# EasyEDA Pro project ProPrj_51boardtest_2024-12-12.epro

# Schematic 51board_Schematic
Board Name: Board1; Create Date: 2024-12-11; Page Name: P1; Project Name: 51board; Schematic Name: 51board_Schematic; Update Date: 2024-12-11; Company: DUOBAO; Drawed: yunshu; Page Size: A4; Version: V1.0
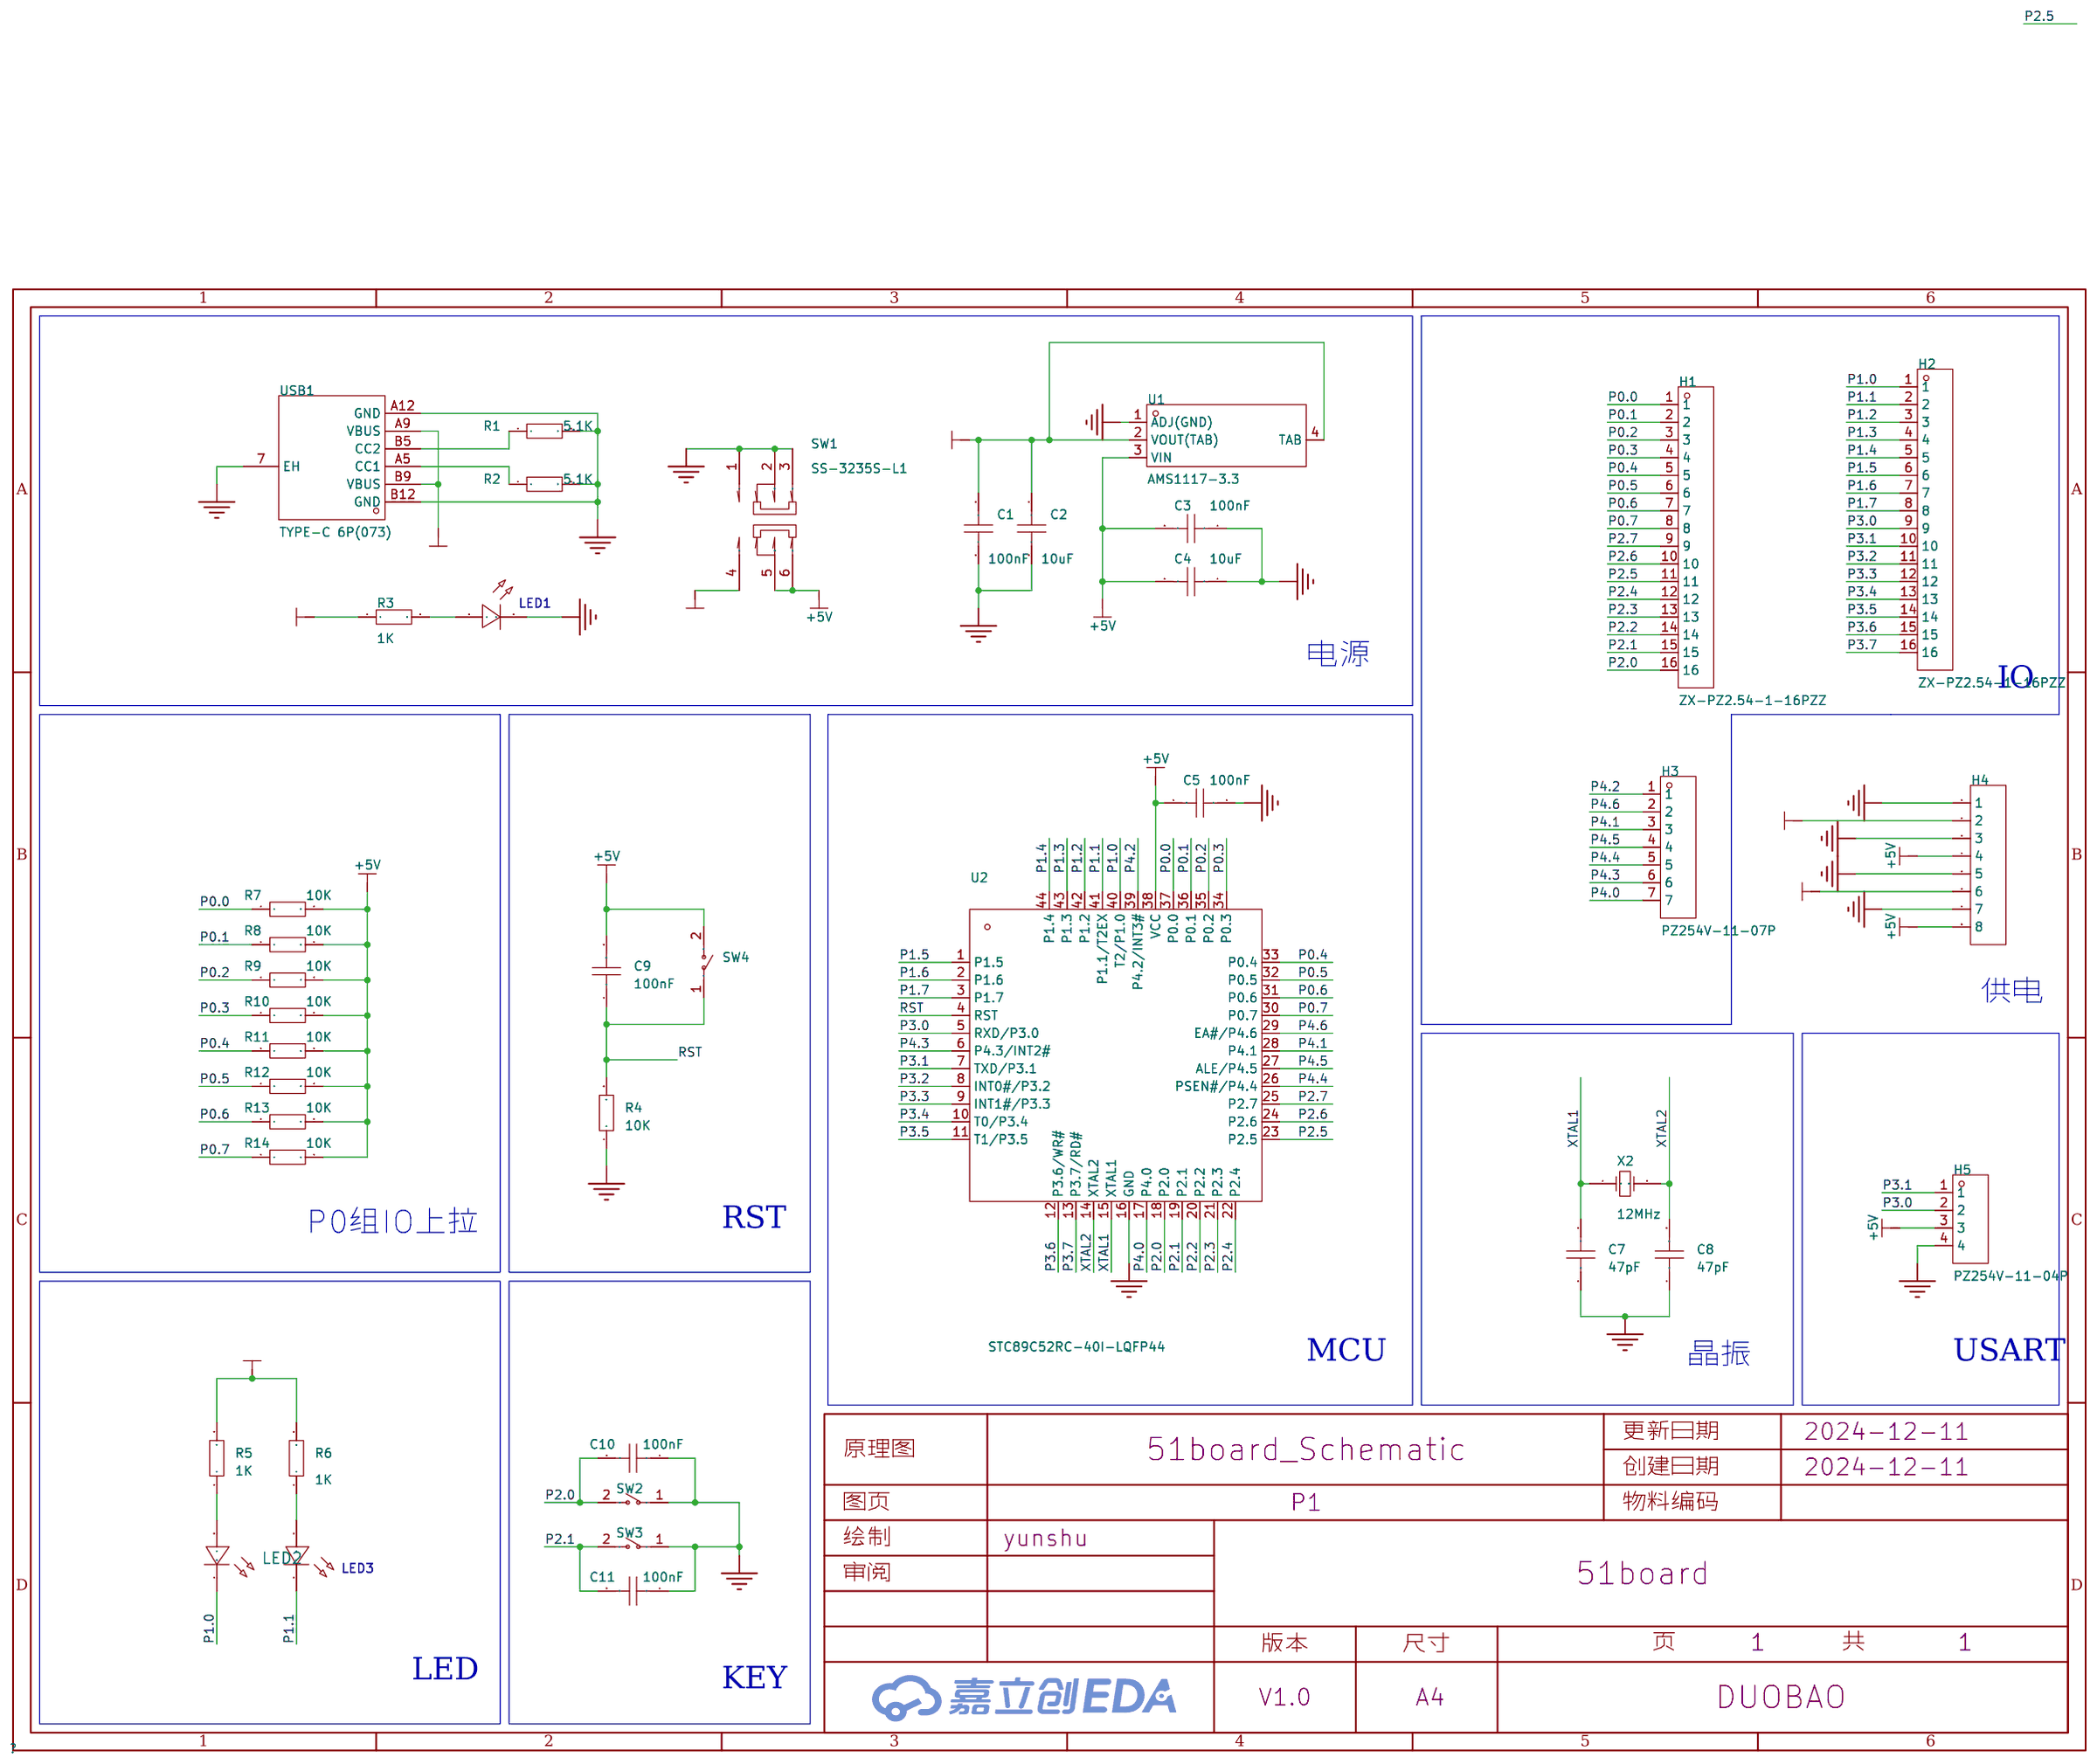
[diagram p0: schematic sheet]

## Parts
C1  100nF  [C0805]
C2  10uF  [C0805]
C3  100nF  [C0805]
C4  10uF  [C0805]
C5  100nF  [C0805]
C7  47pF  [C0805]
C8  47pF  [C0805]
C9  100nF  [C0805]
C10  100nF  [C0805]
C11  100nF  [C0805]
H1  ZX-PZ2.54-1-16PZZ  [HDR-TH_16P-P2.54-V-M-2]
H2  ZX-PZ2.54-1-16PZZ  [HDR-TH_16P-P2.54-V-M-2]
H3  PZ254V-11-07P  [HDR-TH_7P-P2.54-V-M]
H4  -  [HDR-TH_8P-P2.54-V-F-1]
H5  PZ254V-11-04P  [HDR-TH_4P-P2.54-V-M]
LED1  -  [LED_0805]
LED2  -  [LED_0805]
LED3  -  [LED_0805]
R1  5.1K  [R0805]
R2  5.1K  [R0805]
R3  1K  [R0805]
R4  10K  [R0805]
R5  1K  [R0805]
R6  1K  [R0805]
R7  10K  [R0805]
R8  10K  [R0805]
R9  10K  [R0805]
R10  10K  [R0805]
R11  10K  [R0805]
R12  10K  [R0805]
R13  10K  [R0805]
R14  10K  [R0805]
SW1  SS-3235S-L1  [SW-SMD_SS-3235S-LX]
SW2  轻触按键 3x6x2.5mm  [SW-SMD_L6.1-W3.7-LS8.0]
SW3  轻触按键 3x6x2.5mm  [SW-SMD_L6.1-W3.7-LS8.0]
SW4  轻触按键 3x6x2.5mm  [SW-SMD_L6.1-W3.7-LS8.0]
U1  AMS1117-3.3  [SOT-223-4_L6.5-W3.5-P2.30-LS7.0-BR]
U2  STC89C52RC-40I-LQFP44  [LQFP-44_L10.0-W10.0-P0.80-LS12.0-BL]
USB1  TYPE-C 6P(073)  [TYPE-C-SMD_TYPE-C-6P_5]
X2  12MHz  [OSC-TH_BD2.0-P0.50]

## Library data of the parts
C1-C5 C7-C11 = CAP_0805: Supplier Footprint: 0805
H1 H2 = ZX-PZ2.54-1-16PZZ: 插针结构:1x16P;间距:2.54mm;行距:-;圆针/方针:方针;安装类型:直插;排数:单排;总PIN位数:16P;额定电流:3A;额定电压:1kV;配合针长度:6mm;塑高:2.5mm;端接针长度:3mm;触头材质:黄铜;触头镀层:金;工作温度范围:-40℃~+105℃;焊接温度(最大值):-;颜色:黑色;; LCSC Part Name: 1x16P 间距:2.54mm 方针 直插; Supplier Part: C7501270; Manufacturer: Megastar(兆星); Supplier Footprint: 插件,P=2.54mm; JLCPCB Part Class: Extended Part; Datasheet: https://atta.szlcsc.com/upload/public/pdf/source/20231122/E454B24BEC0C004E7BA34E686CD1994E.pdf; Supplier: LCSC; Pin Structure: 1x16P; Pitch: 2.54mm; Circluar Pins/Square Pins: 方针; Mounting Type: 直插; Number of Rows: 单排; Number of Pins: 16P; Current Rating (Max): 3A; Voltage Rating (Max): 1kV; Length of Mating Pin: 6mm; Insulation Height: 2.5mm; Length of End Connection Pin: 3mm; Contact Material: 黄铜; Contact Plating: 金; Operating Temperature Range: -40℃~+105℃; Color: 黑色
H3 = PZ254V-11-07P: 插针结构:1x7P;间距:2.54mm;行距:-;圆针/方针:方针;安装类型:直插;排数:单排;总PIN位数:7P;额定电流:-;额定电压:-;配合针长度:6mm;塑高:2.5mm;端接针长度:3mm;触头材质:黄铜;触头镀层:-;工作温度范围:-40℃~+105℃;颜色:黑色;; LCSC Part Name: 间距:2.54mm 1x7P 直插 方针; Supplier Part: C492406; Manufacturer: XFCN(兴飞); Supplier Footprint: 插件,P=2.54mm; JLCPCB Part Class: Extended Part; Datasheet: https://atta.szlcsc.com/upload/public/pdf/source/20200309/C492406_654C533EE691117E22DD9F76C114C2D9.pdf; Supplier: LCSC; Pin Structure: 1x7P; Pitch: 2.54mm; Circluar Pins/Square Pins: 方针; Mounting Type: 直插; Number of Rows: 单排; Number of Pins: 7P; Length of Mating Pin: 6mm; Insulation Height: 2.5mm; Length of End Connection Pin: 3mm; Contact Material: 黄铜; Operating Temperature Range: -40℃~+105℃; Color: 黑色
H4 = HDR-F_2.54_1x8P: Supplier Part: C27438; Supplier Footprint: 插件
H5 = PZ254V-11-04P: 插针结构:1x4P;间距:2.54mm;行距:-;圆针/方针:方针;安装类型:直插;排数:单排;总PIN位数:4P;额定电流:3A;额定电压:250V;配合针长度:6mm;塑高:2.5mm;端接针长度:3mm;触头材质:-;工作温度范围:-40℃~+105℃;颜色:黑色;; LCSC Part Name: 间距:2.54mm 1x4P 直插 方针; Supplier Part: C2691448; Manufacturer: XFCN(兴飞); Supplier Footprint: 插件,P=2.54mm; JLCPCB Part Class: Extended Part; Datasheet: https://atta.szlcsc.com/upload/public/pdf/source/20200309/C492403_F9F19131791D08044AD4F84F8E751A34.pdf; Supplier: LCSC; Pin Structure: 1x4P; Pitch: 2.54mm; Circluar Pins/Square Pins: 方针; Mounting Type: 直插; Number of Rows: 单排; Number of Pins: 4P; Current Rating (Max): 3A; Voltage Rating (Max): 250V; Length of Mating Pin: 6mm; Insulation Height: 2.5mm; Length of End Connection Pin: 3mm; Operating Temperature Range: -40℃~+105℃; Color: 黑色
LED1 = LED_0805-G: Supplier Footprint: 0805
LED2 = LED_0805-R: Supplier Footprint: 0805
LED3 = LED_0805-B: Supplier Footprint: 0805
R1-R14 = Res_0805: Supplier Footprint: 0805
SW1 = SS-3235S-L1: 电路结构:双刀双掷;安装方式:卧贴;开关颜色:黑色;额定电流(DC):50mA;额定电压(DC):12V;额定电流(AC):50mA;额定电压(AC):12V;机械寿命:1万次;; LCSC Part Name: 柄长2mm 卧贴双档 滑动开关; Supplier Part: C500055; Manufacturer: XKB Connectivity(中国星坤); Supplier Footprint: SMD; JLCPCB Part Class: 扩展库; Datasheet: https://atta.szlcsc.com/upload/public/pdf/source/20211011/39D516E750C13BE9339464E723D9F132.pdf; Supplier: LCSC; Circuit: 双刀双掷; Actuator Style: 矩形柱状; Pin Style: 鸥翼型; Switch Length: 9.1mm; Switch Width: 3.55mm; Switch Height: 3.2mm; Mounting Style: 卧贴; Actuator Color: 黑色; Current Rating (DC): 50mA; Voltage Rating (DC): 12V; Current Rating (AC): 50mA; Voltage Rating (AC): 12V; Mechanical Life: 1万次; Operating Temperature: -40℃~+85℃
SW2-SW4 = 轻触按键 3x6x2.5mm_C5116372: 开关长度:6.05mm;开关宽度:3.65mm;开关高度:2.5mm;机械寿命:-;; Supplier Part: C5116372; Manufacturer: BBJ; Supplier Footprint: SMD; JLCPCB Part Class: 扩展库; Datasheet: https://atta.szlcsc.com/upload/public/pdf/source/20220725/9B611EB1AF8F1817AB348C1FCD97BDC0.pdf; Supplier: LCSC; Switch Length: 6.05mm; Switch Width: 3.65mm; Switch Height: 2.5mm
U1 = AMS1117-3.3_C347222: 输出类型:固定;最大输入电压:18V;输出电压:3.3V;输出电流:1A;电源纹波抑制比(PSRR):60dB@(120Hz);输出极性:正极;; LCSC Part Name: 输出:3.3V 电流:1A 耐压:12V; Supplier Part: C347222; Manufacturer: UMW(友台半导体); Supplier Footprint: SOT-223; JLCPCB Part Class: 扩展库; Datasheet: https://atta.szlcsc.com/upload/public/pdf/source/20231109/155D79A26D9DB04352555A58D5969DC8.pdf; Supplier: LCSC; Output Type: 固定; Maximum Input Voltage: 18V; Output Voltage: 3.3V; Output Current: 1A; Power Supply Rejection Ratio (PSRR): 60dB@(120Hz); Dropout Voltage: 1.3V@(1A); Feature: 过流保护(OCP); Output Polarity: 正极; Number of Outputs: 1
U2 = STC89C52RC-40I-LQFP44: CPU内核:51系列;程序存储容量:8KB;RAM总容量:512Byte;GPIO端口数量:39;工作电压范围:3.3V~5.5V;CPU最大主频:-;程序存储器类型:FLASH;; Supplier Part: C8707; Manufacturer: STC(宏晶); Supplier Footprint: LQFP-44(10x10); JLCPCB Part Class: 扩展库; Datasheet: https://atta.szlcsc.com/upload/public/pdf/source/20131218/1457706663573.pdf; Supplier: LCSC; CPU Core: 51系列; Program Storage Size: 8KB; RAM Size: 512Byte; GPIO Ports Number: 39; Operating Voltage Range: 3.3V~5.5V; Program Memory Type: FLASH; Operating Temperature Range: -40℃~+85℃; 16Bit Timer: 3; UART/USART: 1; Peripheral/Function: 看门狗; Watchdog: 有
USB1 = TYPE-C 6P(073): 连接器类型:Type-C;标准:USB 3.1;公母:母;安装方式:卧贴;触点数量:6P;端口数量:1;额定电流 - 电源:3A;工作温度范围:-25℃~+85℃;; LCSC Part Name: Type-C 母 卧贴; Supplier Part: C668623; Manufacturer: SHOU HAN(首韩); Supplier Footprint: SMD; JLCPCB Part Class: 扩展库; Datasheet: https://atta.szlcsc.com/upload/public/pdf/source/20200618/C668623_A4B260DED7AC1949BAC6AE39E9F4CD80.pdf; Supplier: LCSC; Connector Type: Type-C; Standard: USB 3.1; Gender: 母; Mounting Style: 卧贴; Number of Contacts: 6P; Number of Ports: 1; Current Rating - Power (Max): 3A; Operating Temperature Range: -25℃~+85℃; Rated Voltage (Max): 5V; Connect-Disconnect Life: 1万次; Core Colour: 黑色
X2 = TXD12M0002206LDBEO00S: 晶振类型:直插晶振;频率:12MHz;常温频差:±20ppm;外接负载电容:20pF;频率稳定度(全温):±30ppm;; LCSC Part Name: 12MHz ±20ppm 20pF; Supplier Part: C370892; Manufacturer: YJX(雅晶鑫); Supplier Footprint: DT-26; JLCPCB Part Class: 扩展库; Datasheet: https://atta.szlcsc.com/upload/public/pdf/source/20190212/C370892_CB1688440A1A1FED16C5B19E0C68FC7A.pdf; Supplier: LCSC; Crystal Type: 直插晶振; Normal temperature Frequency Tolerance: ±20ppm; External load capacitor: 20pF; Frequency Stability(Full temperature range): ±30ppm; Equivalent Series Resistance (ESR): 80Ω; Operating Temperature: -20℃~+70℃

## Nets
+5V: C3.2 C4.2 C5.1 C9.2 H4.4 H4.8 H5.3 R7.2 R8.2 R9.2 R10.2 R11.2 R12.2 R13.2 R14.2 SW1.5 SW1.6 SW4.2 U1.3(VIN) U2.38(VCC)
GND: C1.2 C2.2 C3.1 C4.1 C5.2 C7.1 C8.1 C10.1 C11.1 H4.1 H4.3 H4.5 H4.7 H5.4 LED1.1(C) R1.2 R2.2 R4.1 SW1.1 SW1.2 SW1.3 SW2.1 SW3.1 U1.1(ADJ(GND)) U2.16(GND) USB1.7(EH) USB1.A12(GND) USB1.B12(GND)
VCC+3.3V: C1.1 C2.1 H4.2 H4.6 R3.1 R5.2 R6.2 U1.2(VOUT(TAB)) U1.4(TAB)
VCC+5V: SW1.4 USB1.A9(VBUS) USB1.B9(VBUS)
P0.0: H1.1 R7.1 U2.37(P0.0)
P0.1: H1.2 R8.1 U2.36(P0.1)
P0.2: H1.3 R9.1 U2.35(P0.2)
P0.3: H1.4 R10.1 U2.34(P0.3)
P0.4: H1.5 R11.1 U2.33(P0.4)
P0.5: H1.6 R12.1 U2.32(P0.5)
P0.6: H1.7 R13.1 U2.31(P0.6)
P0.7: H1.8 R14.1 U2.30(P0.7)
P1.0: H2.1 LED2.1(C) U2.40(T2/P1.0)
P1.1: H2.2 LED3.1(C) U2.41(P1.1/T2EX)
P1.2: H2.3 U2.42(P1.2)
P1.3: H2.4 U2.43(P1.3)
P1.4: H2.5 U2.44(P1.4)
P1.5: H2.6 U2.1(P1.5)
P1.6: H2.7 U2.2(P1.6)
P1.7: H2.8 U2.3(P1.7)
P2.0: C10.2 H1.16 SW2.2 U2.18(P2.0)
P2.1: C11.2 H1.15 SW3.2 U2.19(P2.1)
P2.2: H1.14 U2.20(P2.2)
P2.3: H1.13 U2.21(P2.3)
P2.4: H1.12 U2.22(P2.4)
P2.5: H1.11 U2.23(P2.5)
P2.6: H1.10 U2.24(P2.6)
P2.7: H1.9 U2.25(P2.7)
P3.0: H2.9 H5.2 U2.5(RXD/P3.0)
P3.1: H2.10 H5.1 U2.7(TXD/P3.1)
P3.2: H2.11 U2.8(INT0#/P3.2)
P3.3: H2.12 U2.9(INT1#/P3.3)
P3.4: H2.13 U2.10(T0/P3.4)
P3.5: H2.14 U2.11(T1/P3.5)
P3.6: H2.15 U2.12(P3.6/WR#)
P3.7: H2.16 U2.13(P3.7/RD#)
P4.0: H3.7 U2.17(P4.0)
P4.1: H3.3 U2.28(P4.1)
P4.2: H3.1 U2.39(P4.2/INT3#)
P4.3: H3.6 U2.6(P4.3/INT2#)
P4.4: H3.5 U2.26(PSEN#/P4.4)
P4.5: H3.4 U2.27(ALE/P4.5)
P4.6: H3.2 U2.29(EA#/P4.6)
RST: C9.1 R4.2 SW4.1 U2.4(RST)
XTAL1: C7.2 U2.15(XTAL1) X2.1(OSC1)
XTAL2: C8.2 U2.14(XTAL2) X2.2(OSC2)
$LED1_2: LED1.2(A) R3.2
$LED2_2: LED2.2(A) R5.1
$LED3_2: LED3.2(A) R6.1
$R1_1: R1.1 USB1.B5(CC2)
$R2_1: R2.1 USB1.A5(CC1)

## Notes on the sheet
- 电源
- IO
- 供电
- P0组IO上拉
- RST
- MCU
- 晶振
- USART
- LED
- KEY

# Board 51board_PCB
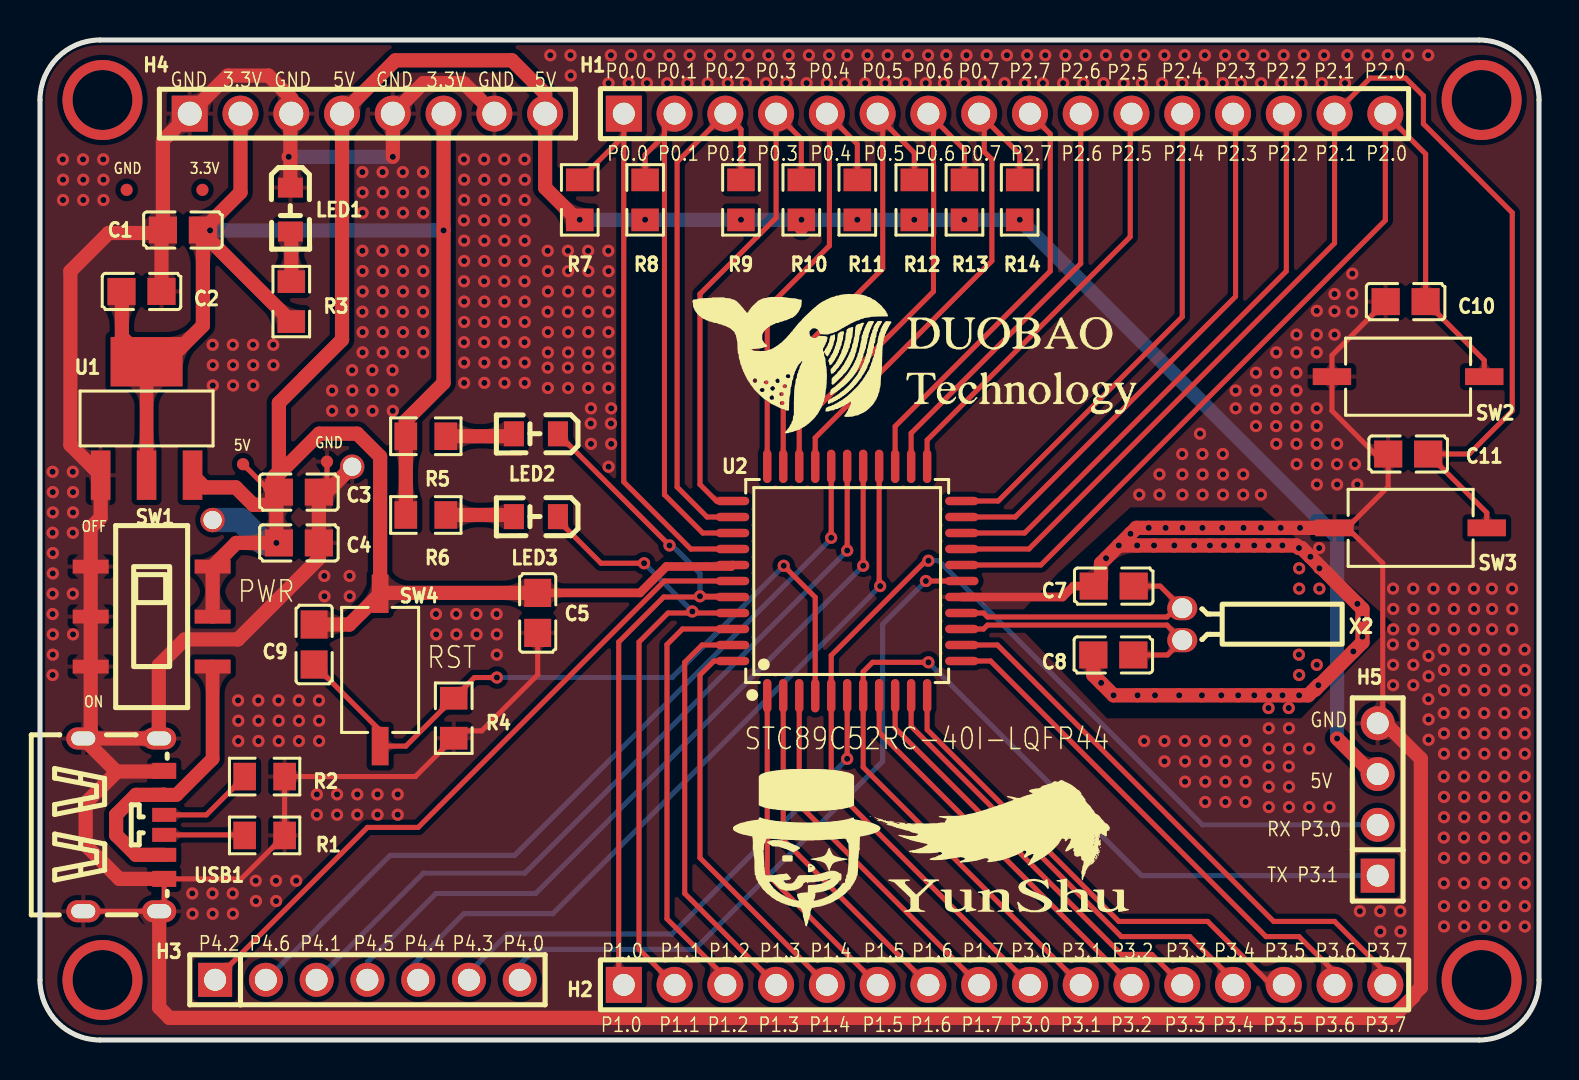
[diagram p1: board, top side]
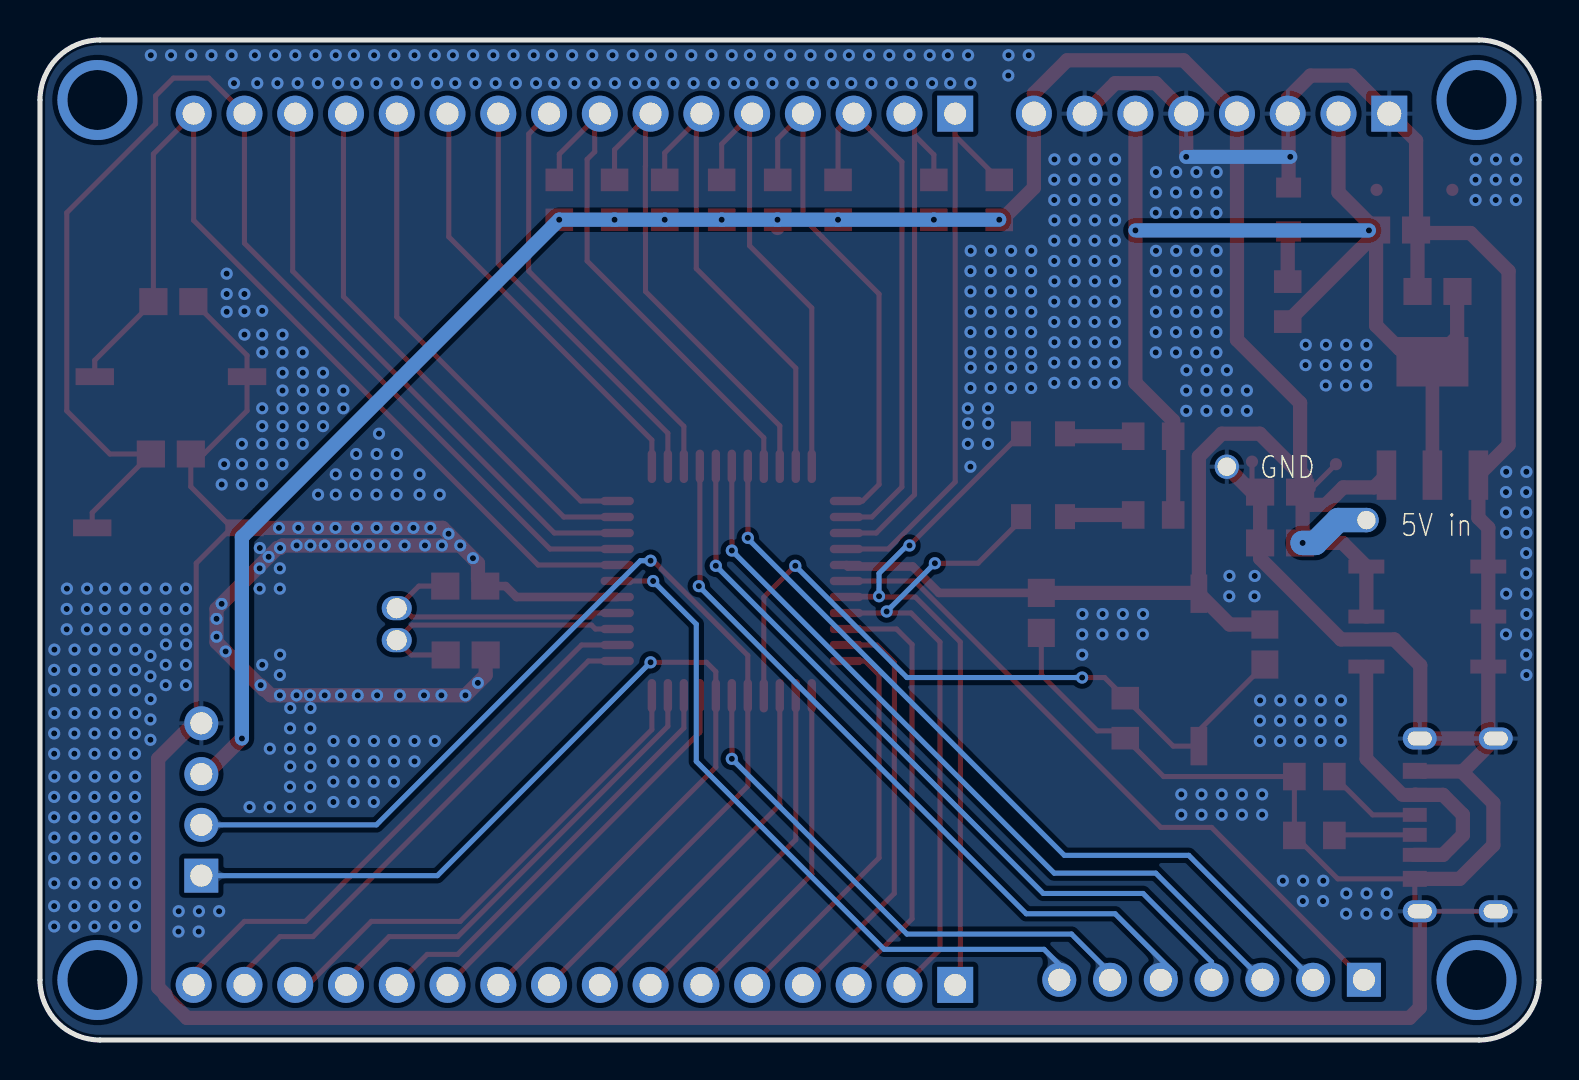
[diagram p2: board, bottom side, seen from below]

Outline 75 x 50 mm; copper layers: Top Layer, Bottom Layer. Coordinates in mm from the lower left corner of the outline.
Outline path: 0,47 0,3 arc(0.88,0.88) 3,0 72,0 arc(74.12,0.88) 75,3 75,47 arc(74.12,49.12) 72,50 3,50 arc(0.88,49.12) 0,47
Stack: Top Layer 0.035mm / Dielectric1 1.51mm FR4 er 4.5 / Bottom Layer 0.035mm

## Design rules (mm)
net XTAL1: DP1
net XTAL2: DP1
template: 自定义配置
spacing copperThickness1oz (default): track to track 0.102, other pairs 0.152 to 0.3
spacing copperThickness2oz: track to track 0.203, other pairs 0.152 to 0.3
track width copperThickness1oz (default): min 0.127, default 0.254, max 2.54
track width copperThickness2oz: min 0.203, default 0.254, max 2.54
differential pair differentialPair (default): width min 0.127, default 0.254, max 2.54; gap min 0.152, default 0.152
via viaSize (default): diameter min 0.5, default 0.61, max 10; hole min 0.3, default 0.305, max 6.299

## Placement (name value [footprint] x y rotation side)
C1  100nF  [C0805]  7.15 40.5 180 top
C2  10uF  [C0805]  5.08 37.43 0 top
C3  100nF  [C0805]  12.95 27.39 180 top
C4  10uF  [C0805]  12.95 24.85 180 top
C5  100nF  [C0805]  24.9 21.35 270 top
C7  47pF  [C0805]  53.72 22.69 0 top
C8  47pF  [C0805]  53.7 19.25 0 top
C9  100nF  [C0805]  13.72 19.77 90 top
C10  100nF  [C0805]  68.33 36.92 0 top
C11  100nF  [C0805]  68.45 29.3 0 top
H1  ZX-PZ2.54-1-16PZZ  [HDR-TH_16P-P2.54-V-M-2]  48.26 46.32 0 top
H2  ZX-PZ2.54-1-16PZZ  [HDR-TH_16P-P2.54-V-M-2]  48.26 2.76 0 top
H3  PZ254V-11-07P  [HDR-TH_7P-P2.54-V-M]  16.38 3.01 0 top
H4  -  [HDR-TH_8P-P2.54-V-F-1]  16.38 46.32 0 top
H5  PZ254V-11-04P  [HDR-TH_4P-P2.54-V-M]  66.93 12.03 90 top
LED1  -  [LED_0805]  12.52 41.47 270 top
LED2  -  [LED_0805]  24.77 30.31 180 top
LED3  -  [LED_0805]  24.77 26.17 180 top
NOREF  -  [Pad_e2690]  10.16 28.79 0 top
NOREF#2  -  [Pad_e2691]  14.36 28.92 0 top
NOREF#3  -  [Pad_e4806]  15.62 28.66 0 top
NOREF#4  -  [Pad_e5037]  8.64 26 0 top
NOREF#5  -  [Pad_e2711]  4.34 42.51 0 top
NOREF#6  -  [Pad_e2710]  8.13 42.51 0 top
R1  5.1K  [R0805]  11.24 10.23 0 top
R2  5.1K  [R0805]  11.24 13.17 0 top
R3  1K  [R0805]  12.57 36.92 90 top
R4  10K  [R0805]  20.7 16.09 90 top
R5  1K  [R0805]  19.3 30.19 180 top
R6  1K  [R0805]  19.3 26.25 180 top
R7  10K  [R0805]  27.01 42.01 270 top
R8  10K  [R0805]  30.28 42.01 270 top
R9  10K  [R0805]  35.07 42.01 270 top
R10  10K  [R0805]  38.09 42.01 270 top
R11  10K  [R0805]  40.89 42.01 270 top
R12  10K  [R0805]  43.74 42.01 270 top
R13  10K  [R0805]  46.25 42.01 270 top
R14  10K  [R0805]  49.02 42.01 270 top
SW1  SS-3235S-L1  [SW-SMD_SS-3235S-LX]  5.59 21.17 90 top
SW2  轻触按键 3x6x2.5mm  [SW-SMD_L6.1-W3.7-LS8.0]  68.45 33.17 180 top
SW3  轻触按键 3x6x2.5mm  [SW-SMD_L6.1-W3.7-LS8.0]  68.58 25.61 180 top
SW4  轻触按键 3x6x2.5mm  [SW-SMD_L6.1-W3.7-LS8.0]  17.02 18.5 270 top
U1  AMS1117-3.3  [SOT-223-4_L6.5-W3.5-P2.30-LS7.0-BR]  5.33 31.08 270 top
U2  STC89C52RC-40I-LQFP44  [LQFP-44_L10.0-W10.0-P0.80-LS12.0-BL]  40.39 22.95 0 top
USB1  TYPE-C 6P(073)  [TYPE-C-SMD_TYPE-C-6P_5]  4.19 10.76 270 top
X2  12MHz  [OSC-TH_BD2.0-P0.50]  57.15 20.79 270 top

## Footprints (pads in the part's own frame, mm; a bottom-side part is the same pattern mirrored in y, then rotated)
C0805
  rect 1.41x1.35 smd: 1(-1,0) 2(1,0)
HDR-TH_4P-P2.54-V-M
  rect 1.7x1.7 hole 1.1: 1(-3.81,0)
  round 1.7 hole 1.1: 2(-1.27,0) 3(1.27,0) 4(3.81,0)
HDR-TH_7P-P2.54-V-M
  rect 1.7x1.7 hole 1.1: 1(-7.62,0)
  round 1.7 hole 1.1: 2(-5.08,0) 3(-2.54,0) 4(0,0) 5(2.54,0) 6(5.08,0) 7(7.62,0)
HDR-TH_8P-P2.54-V-F-1
  rect 1.8x1.8 hole 1.2: 1(-8.89,0)
  round 1.8 hole 1.2: 2(-6.35,0) 3(-3.81,0) 4(-1.27,0) 5(1.27,0) 6(3.81,0) 7(6.35,0) 8(8.89,0)
HDR-TH_16P-P2.54-V-M-2
  rect 1.8x1.8 hole 1.1: 1(-19.05,0)
  round 1.8 hole 1.1: 2(-16.51,0) 3(-13.97,0) 4(-11.43,0) 5(-8.89,0) 6(-6.35,0) 7(-3.81,0) 8(-1.27,0) 9(1.27,0) 10(3.81,0) 11(6.35,0) 12(8.89,0) 13(11.43,0) 14(13.97,0) 15(16.51,0) 16(19.05,0)
LED_0805
  rect 1x1.25 smd: 1(-1.15,0.005) 2(1.05,0.005)
LQFP-44_L10.0-W10.0-P0.80-LS12.0-BL
  oval 0.42x1.67 smd: 1(-4,-5.735) 2(-3.2,-5.735) 3(-2.4,-5.735) 4(-1.6,-5.735) 5(-0.8,-5.735) 6(0,-5.735) 7(0.8,-5.735) 8(1.6,-5.735) 9(2.4,-5.735) 10(3.2,-5.735) 11(4,-5.735) 23(4,5.735) 24(3.2,5.735) 25(2.4,5.735) 26(1.6,5.735) 27(0.8,5.735) 28(0,5.735) 29(-0.8,5.735) 30(-1.6,5.735) 31(-2.4,5.735) 32(-3.2,5.735) 33(-4,5.735)
  oval 1.67x0.42 smd: 12(5.735,-4) 13(5.735,-3.2) 14(5.735,-2.4) 15(5.735,-1.6) 16(5.735,-0.8) 17(5.735,0) 18(5.735,0.8) 19(5.735,1.6) 20(5.735,2.4) 21(5.735,3.2) 22(5.735,4) 34(-5.735,4) 35(-5.735,3.2) 36(-5.735,2.4) 37(-5.735,1.6) 38(-5.735,0.8) 39(-5.735,0) 40(-5.735,-0.8) 41(-5.735,-1.6) 42(-5.735,-2.4) 43(-5.735,-3.2) 44(-5.735,-4)
OSC-TH_BD2.0-P0.50
  oval 1.2x1.5 hole 1: 1(-0.8,0) 2(0.8,0)
Pad_e2690
  round 0.61 smd: TP1(0,0)
Pad_e2691
  round 0.61 smd: TP2(0,0)
Pad_e2710
  round 0.61 smd: TP3(0,0)
Pad_e2711
  round 0.61 smd: TP4(0,0)
Pad_e4806
  round 1.219 hole 0.914: 1(0,0)
Pad_e5037
  round 1.219 hole 0.914: 1(0,0)
R0805
  rect 1.133x1.377 smd: 1(-1,0) 2(1,0)
SOT-223-4_L6.5-W3.5-P2.30-LS7.0-BR
  rect 2.47x0.98 smd: 1(2.835,-2.3) 2(2.835,0) 3(2.835,2.3)
  rect 2.47x3.6 smd: 4(-2.835,0)
SW-SMD_L6.1-W3.7-LS8.0
  rect 1.92x0.84 smd: 1(3.81,0) 2(-3.81,0)
SW-SMD_SS-3235S-LX
  rect 0.7x1.8 smd: 1(-2.5,3.05) 2(0,3.05) 3(2.5,3.05) 4(-2.5,-3.05) 5(0,-3.05) 6(2.5,-3.05)
TYPE-C-SMD_TYPE-C-6P_5
  oval 1.1x1.7 hole 0.7x1.2: 7(-4.32,1.775) 7(-4.32,-2.025) 7(4.32,1.775) 7(4.32,-2.025)
  rect 0.7x1.2 smd: A5(-0.5,2.025) A9(1.5,2.025) B5(0.5,2.025) B9(-1.5,2.025)
  rect 0.8x1.2 smd: A12(2.7,2.025) B12(-2.7,2.025)

## Nets
As in the schematic, except:
+5V: C3.2 C4.2 C5.1 C9.2 H4.4 H4.8 H5.3 NOREF.TP1 NOREF#4.1 R7.2 R8.2 R9.2 R10.2 R11.2 R12.2 R13.2 R14.2 SW1.5 SW1.6 SW4.2 U1.3 U2.38
GND: C1.2 C2.2 C3.1 C4.1 C5.2 C7.1 C8.1 C10.1 C11.1 H4.1 H4.3 H4.5 H4.7 H5.4 LED1.1 NOREF#2.TP2 NOREF#3.1 R1.2 R2.2 R4.1 SW1.1 SW1.2 SW1.3 SW2.1 SW3.1 U1.1 U2.16 USB1.7 USB1.A12 USB1.B12

Pads without a net: NOREF#5 TP4; NOREF#6 TP3

## Via types
v1: diameter 4, hole 3, Top Layer to Bottom Layer, 4 vias
v2: diameter 0.61, hole 0.305, Top Layer to Bottom Layer, 574 vias
v3: diameter 1.219, hole 0.305, Top Layer to Bottom Layer, 1 via

## Routing (per net, layer and track width the routed paths; a pad name or vN(x,y) marks a point on that pad's centre or on a via; arc(x,y) is an arc through that point)
+5V: length 151.5
  Top Layer w0.254: 11.3,27.52 11.3,27.65 NOREF.TP1
  Top Layer w0.432: C5.1 30.02,22.35 31.34,23.67 34.58,23.67 U2.38
  Top Layer w0.711: 11.95,27.65 C3.2 11.83,27.27 v3(11.83,24.85) 9.82,24.85 SW1.6 SW1.5 ; 11.95,28.43 11.68,28.16 ; 11.95,28.43 12.02,28.36 13.97,30.31 15.88,30.31 17.02,29.17 SW4.2 ; 11.95,28.43 11.95,31.86 15.11,35.01 H4.4 17.78,48.98 23.61,48.98 25.27,47.32 H4.8 25.27,42.61 27.01,40.88 ; 7.63,28.24 8.25,27.63 9.8,27.63 10.67,26.76 11.43,26.76 11.68,27.01 ; C9.2 15.48,20.77 SW4.2 ; R14.2 49.02,41 49.03,40.98 ; v2(64.9,15.08) 66.67,13.3 H5.3 ; 30.35,40.88 30.28,40.96 R8.2 ; 43.74,40.93 43.74,41 ; C5.1 17.06,22.35 SW4.2 ; 40.89,40.93 40.89,41 ; 38.1,40.6 38.1,40.99 38.09,41 ; 35.02,40.89 35.07,40.94 35.07,41
  Bottom Layer w0.711: v2(27.01,41.01) v2(30.28,41.01) v2(35.07,41.01) v2(38.1,41.01) v2(40.89,41.01) v2(43.74,41.01) v2(46.25,41.01) v2(49.02,41.01) 64.9,25.14 v2(64.9,15.08)
  Bottom Layer w1.219: v3(11.83,24.85) 11.19,24.85 10.05,26 NOREF#4.1
GND: length 294.3
  Top Layer w0.254: USB1.A12 6.22,6.69 5.97,6.44 2.17,6.44 ; USB1.A12 10.07,8.06 R1.2 R2.2 18.78,13.17 R4.1 21.07,15.46 22.1,15.46 24.9,18.26 C5.2 ; USB1.A12 5.58,8.06 ; C11.1 67.45,27.66 65.4,25.61 ; C11.1 67.56,29.3 ; C11.1 66.8,29.3 64.64,31.46 SW2.1 64.64,34.23 C10.1 ; 65.4,25.61 65.41,25.61 67.18,23.84 67.18,16.09 H5.4 ; 65.4,25.61 SW3.1 ; C3.1 14.36,27.8 NOREF#2.TP2 ; 5.81,13.42 6.18,13.42 6.22,13.46
  Top Layer w0.432: U2.16 51.16,22.15 51.7,22.69 C7.1
  Top Layer w0.711: C8.1 52.7,18.25 v2(53.09,17.86) v2(53.71,17.23) v2(54.92,17.23) v2(55.79,17.23) v2(57,17.23) v2(58.13,17.23) v2(59.1,17.23) v2(59.95,17.23) v2(60.75,17.23) v2(61.49,17.23) v2(62.16,17.23) v2(63,17.23) 63.45,17.23 v2(63.96,17.74) ; 5.97,6.44 5.97,1.62 6.48,1.1 67.65,1.1 68.72,2.17 68.72,2.26 69.09,2.63 69.09,14.06 67.31,15.84 H5.4 ; v2(12.45,44.16) 12.46,44.17 12.53,44.17 ; v2(17.65,44.16) H4.5 19.18,47.84 21.21,47.84 22.1,46.95 ; v2(53.98,24.73) v2(54.56,25.31) 54.85,25.61 v2(55.47,25.61) v2(56.32,25.61) v2(57.17,25.61) v2(58.16,25.61) v2(59.15,25.61) v2(60.21,25.61) v2(61.08,25.61) v2(62.08,25.61) v2(63.04,25.61) SW3.1 ; v2(53.98,24.73) v2(54.89,24.73) v2(55.74,24.73) v2(56.75,24.73) v2(57.75,24.73) v2(58.53,24.73) v2(59.24,24.73) v2(59.91,24.73) v2(60.75,24.73) v2(61.47,24.73) v2(62.16,24.73) 62.86,24.73 v2(62.99,24.6) 63.12,24.6 v2(63.56,24.16) v2(65.91,21.81) 66.17,21.55 v2(66.17,21.06) 66.17,19.89 v2(65.71,19.43) 63.8,17.52 63.78,17.52 ; v2(53.98,24.73) v2(53.34,24.09) 53.09,23.84 53.09,23.06 C7.1 ; 3.86,13.42 2.29,11.85 2.29,9.74 3.97,8.06 5.58,8.06 ; 3.86,13.42 5.81,13.42 ; 3.86,13.42 3.82,13.42 2.17,15.08 ; C1.2 6.15,44.98 H4.1 9.4,48.22 11.43,48.22 12.57,47.08 H4.3 12.53,46.27 12.53,44.17 ; 12.53,42.62 12.53,44.17 ; 2.17,15.08 2.54,15.45 SW1.1 SW1.2 SW1.3 2.54,25.61 3.03,26.11 U1.1 1.52,29.75 1.52,38.44 3.43,40.35 5.59,40.35 5.71,40.47 ; 2.17,15.08 USB1.7 5.94,15.1 5.94,18.73 7.24,20.03 9.91,20.03 13.95,24.08 C4.1 C3.1 ; NOREF#3.1 14.22,27.27 ; C2.2 6.08,40.33
  Bottom Layer w0.711: v2(17.65,44.16) v2(12.45,44.16)
  vias: v2(0.63,28.41) v2(0.64,27.39) v2(0.64,26.38) v2(0.63,25.36) v2(0.64,24.35) v2(0.64,23.33) v2(0.63,22.31) v2(0.63,21.3) v2(0.64,20.28) v2(0.64,19.27) v2(0.63,18.25) v2(1.14,44.03) v2(1.15,43.02) v2(1.15,42) v2(1.64,28.41) v2(1.65,27.39) v2(1.65,26.38) v2(1.64,25.36) v2(1.64,22.31) v2(1.65,20.28) v2(2.15,44.03) v2(2.16,43.02) v2(2.16,42) v2(3.16,44.03) v2(3.17,43.02) v2(3.17,42) v2(7.62,7.33) v2(7.63,6.31) v2(8.64,34.76) v2(8.65,33.74) v2(8.65,32.73) v2(8.63,7.33) v2(8.64,6.31) v2(9.65,34.76) v2(9.66,33.74) v2(9.66,32.73) v2(9.64,7.33) v2(9.65,6.31) v2(9.91,16.98) v2(9.92,15.96) v2(9.92,14.95) v2(10.66,34.76) v2(10.67,33.74) v2(10.67,32.73) v2(10.8,7.96) v2(10.8,6.95) v2(10.92,16.98) v2(10.93,15.96) v2(10.93,14.95) v2(11.67,34.76) v2(11.68,33.74) v2(11.81,7.96) v2(11.82,6.95) v2(11.93,16.98) v2(11.94,15.96) v2(11.94,14.95) v2(12.82,7.96) v2(12.94,16.98) v2(12.95,15.96) v2(12.95,14.95) v2(13.85,12.28) v2(13.85,11.27) v2(13.95,16.98) v2(13.96,15.96) v2(13.96,14.95) v2(14.22,23.2) v2(14.23,22.19) v2(14.62,32.47) v2(14.62,31.46) v2(14.86,12.28) v2(14.86,11.27) v2(15.49,23.2) v2(15.5,22.19) v2(15.62,33.49) v2(15.63,32.47) v2(15.63,31.46) v2(15.88,12.28) v2(15.88,11.27) v2(16.13,43.4) v2(16.14,42.38) v2(16.14,41.36) v2(16.13,39.46) v2(16.14,38.44) v2(16.14,37.43) v2(16.13,36.41) v2(16.14,35.39) v2(16.14,34.38) v2(16.63,33.49) v2(16.64,32.47) v2(16.64,31.46) v2(16.89,12.28) v2(16.89,11.27) v2(17.14,43.4) v2(17.15,42.38) v2(17.15,41.36) v2(17.14,39.46) v2(17.15,38.44) v2(17.15,37.43) v2(17.14,36.41) v2(17.15,35.39) v2(17.15,34.38) v2(17.64,33.49) v2(17.65,32.47) v2(17.65,31.46) v2(17.9,12.28) v2(17.9,11.27) v2(18.15,43.4) v2(18.16,42.38) v2(18.16,41.36) v2(18.15,39.46) v2(18.16,38.44) v2(18.16,37.43) v2(18.15,36.41) v2(18.16,35.39) v2(18.16,34.38) v2(19.16,43.4) v2(19.17,42.38) v2(19.17,41.36) v2(19.16,39.46) v2(19.17,38.44) v2(19.17,37.43) v2(19.16,36.41) v2(19.17,35.39) v2(19.17,34.38) v2(19.81,21.3) v2(19.82,20.28) v2(20.82,21.3) v2(20.83,20.28) v2(21.21,44.03) v2(21.22,43.02) v2(21.22,42) v2(21.21,40.98) v2(21.22,39.97) v2(21.22,38.95) v2(21.21,37.94) v2(21.22,36.92) v2(21.22,35.9) v2(21.21,34.89) v2(21.22,33.87) v2(21.22,32.86) v2(21.83,21.3) v2(21.84,20.28) v2(22.22,44.03) v2(22.23,43.02) v2(22.23,42) v2(22.22,40.98) v2(22.23,39.97) v2(22.23,38.95) v2(22.22,37.94) v2(22.23,36.92) v2(22.23,35.9) v2(22.22,34.89) v2(22.23,33.87) v2(22.23,32.86) v2(22.84,21.3) v2(22.86,20.28) v2(22.86,19.27) v2(23.23,44.03) v2(23.24,43.02) v2(23.24,42) v2(23.23,40.98) v2(23.24,39.97) v2(23.24,38.95) v2(23.23,37.94) v2(23.24,36.92) v2(23.24,35.9) v2(23.23,34.89) v2(23.24,33.87) v2(23.24,32.86) v2(24.24,44.03) v2(24.25,43.02) v2(24.25,42) v2(24.24,40.98) v2(24.25,39.97) v2(24.25,38.95) v2(24.24,37.94) v2(24.25,36.92) v2(24.25,35.9) v2(24.24,34.89) v2(24.25,33.87) v2(24.25,32.86) v2(25.4,39.46) v2(25.41,38.44) v2(25.41,37.43) v2(25.4,36.41) v2(25.41,35.39) v2(25.41,34.38) v2(25.4,33.62) v2(25.41,32.6) v2(25.53,49.24) v2(26.41,39.46) v2(26.42,38.44) v2(26.42,37.43) v2(26.41,36.41) v2(26.42,35.39) v2(26.42,34.38) v2(26.41,33.62) v2(26.42,32.6) v2(26.54,49.24) v2(26.55,48.22) v2(27.42,39.46) v2(27.43,38.44) v2(27.43,37.43) v2(27.42,36.41) v2(27.43,35.39) v2(27.43,34.38) v2(27.42,33.62) v2(27.43,32.6) v2(27.57,31.58) v2(27.56,30.82) v2(27.57,29.81) v2(28.45,47.84) v2(28.44,39.46) v2(28.45,38.44) v2(28.45,37.43) v2(28.44,36.41) v2(28.45,35.39) v2(28.45,34.38) v2(28.44,33.62) v2(28.45,32.6) v2(28.45,28.66) v2(28.56,49.24) v2(28.57,30.82) v2(28.58,31.58) v2(28.58,29.81) v2(29.46,47.84) v2(29.58,49.24) v2(30.37,47.84) v2(30.48,49.24) v2(31.38,47.84) v2(31.5,49.24) v2(32.39,47.84) v2(32.51,49.24) v2(33.4,47.84) v2(33.52,49.24) v2(34.41,47.84) v2(34.53,49.24) v2(35.32,47.84) v2(35.44,49.24) v2(36.33,47.84) v2(36.45,49.24) v2(37.34,47.84) v2(37.46,49.24) v2(38.35,47.84) v2(38.47,49.24) v2(39.36,47.84) v2(39.48,49.24) v2(40.27,47.84) v2(40.39,49.24) v2(41.28,47.84) v2(41.4,49.24) v2(42.3,47.84) v2(42.41,49.24) v2(43.31,47.84) v2(43.42,49.24) v2(44.32,47.84) v2(44.43,49.24) v2(45.23,47.84) v2(45.34,49.24) v2(46.24,47.84) v2(46.36,49.24) v2(47.25,47.84) v2(47.37,49.24) v2(48.26,47.84) v2(48.38,49.24) v2(49.27,47.84) v2(49.39,49.24) v2(50.18,47.84) v2(50.3,49.24) v2(51.19,47.84) v2(51.31,49.24) v2(52.2,47.84) v2(52.32,49.24) v2(53.21,47.84) v2(53.33,49.24) v2(54.22,47.84) v2(54.34,49.24) v2(55,27.27) v2(55.13,47.84) v2(55.25,49.24) v2(55.24,14.95) v2(56.01,28.28) v2(56.01,27.27) v2(56.14,47.84) v2(56.26,49.24) v2(56.26,14.95) v2(56.26,13.93) v2(57.15,47.84) v2(57.15,29.3) v2(57.16,28.28) v2(57.16,27.27) v2(57.27,49.24) v2(57.28,14.95) v2(57.29,13.93) v2(57.29,12.92) v2(58.04,30.31) v2(58.17,47.84) v2(58.16,29.3) v2(58.17,28.28) v2(58.17,27.27) v2(58.28,49.24) v2(58.29,14.95) v2(58.3,13.93) v2(58.3,12.92) v2(58.3,11.9) v2(59.18,47.84) v2(59.18,29.3) v2(59.19,28.28) v2(59.19,27.27) v2(59.29,49.24) v2(59.3,14.95) v2(59.31,13.93) v2(59.31,12.92) v2(59.31,11.9) v2(59.82,32.47) v2(59.82,31.58) v2(60.09,47.84) v2(60.2,49.24) v2(60.2,28.28) v2(60.2,27.27) v2(60.31,14.95) v2(60.32,13.93) v2(60.32,12.92) v2(60.32,11.9) v2(60.84,33.36) v2(60.83,32.47) v2(60.83,31.58) v2(60.84,30.7) v2(61.1,47.84) v2(61.09,27.27) v2(61.21,49.24) v2(61.47,16.6) v2(61.47,13.68) v2(61.48,15.58) v2(61.48,14.57) v2(61.48,12.66) v2(61.48,11.65) v2(61.85,34.38) v2(61.85,33.36) v2(61.84,32.47) v2(61.84,31.58) v2(61.85,30.7) v2(61.85,29.81) v2(62.11,47.84) v2(62.23,49.24) v2(62.48,16.6) v2(62.49,15.58) v2(62.49,14.57) v2(62.48,13.68) v2(62.49,12.66) v2(62.49,11.65) v2(62.86,35.27) v2(62.86,34.38) v2(62.86,33.36) v2(62.86,32.47) v2(62.86,31.58) v2(62.86,30.7) v2(62.86,29.81) v2(62.87,28.79) v2(63,23.58) v2(63,22.57) v2(62.99,19.27) v2(63,18.25) v2(63.12,47.84) v2(63.24,49.24) v2(63.5,14.57) v2(63.5,11.65) v2(63.88,34.38) v2(63.88,29.81) v2(63.88,36.46) v2(63.88,35.27) v2(63.88,31.58) v2(63.88,30.7) v2(63.88,28.79) v2(63.89,27.78) v2(63.88,18.76) v2(64,24.6) v2(64.01,23.58) v2(64.01,22.57) v2(64.13,47.84) v2(64.25,49.24) v2(64.51,11.65) v2(64.77,37.3) v2(64.77,36.44) v2(64.77,35.27) v2(64.9,29.81) v2(64.89,28.79) v2(64.9,27.78) v2(65.29,47.84) v2(65.41,49.24) v2(65.66,38.32) v2(65.66,37.3) v2(65.66,36.41) v2(65.79,28.79) v2(65.91,27.78) v2(66.04,6.44) v2(66.17,20.16) v2(66.42,49.24) v2(67.05,6.44) v2(67.06,5.42) v2(67.43,49.24) v2(67.7,22.57) v2(67.71,21.55) v2(67.71,20.54) v2(67.69,19.77) v2(67.7,18.76) v2(67.7,17.74) v2(68.06,6.44) v2(68.07,5.42) v2(68.44,49.24) v2(68.71,22.57) v2(68.72,21.55) v2(68.72,20.54) v2(68.7,19.77) v2(68.71,18.76) v2(68.71,17.74) v2(69.45,49.24) v2(69.47,19.2) v2(69.47,18.19) v2(69.46,17.04) v2(69.47,16.03) v2(69.47,15.01) v2(69.72,22.57) v2(69.73,21.55) v2(69.73,20.54) v2(70.24,19.52) v2(70.25,18.5) v2(70.25,17.49) v2(70.24,16.34) v2(70.25,15.33) v2(70.25,14.31) v2(70.24,13.17) v2(70.25,12.15) v2(70.25,11.14) v2(70.24,10.12) v2(70.25,9.11) v2(70.24,7.84) v2(70.25,6.69) v2(70.25,5.68) v2(70.73,22.57) v2(70.74,21.55) v2(70.74,20.54) v2(71.25,19.52) v2(71.26,18.5) v2(71.26,17.49) v2(71.25,16.34) v2(71.26,15.33) v2(71.26,14.31) v2(71.25,13.17) v2(71.26,12.15) v2(71.26,11.14) v2(71.25,10.12) v2(71.26,9.11) v2(71.25,7.84) v2(71.26,6.69) v2(71.26,5.68) v2(71.74,22.57) v2(71.75,21.55) v2(71.75,20.54) v2(72.26,19.52) v2(72.27,18.5) v2(72.27,17.49) v2(72.26,16.34) v2(72.27,15.33) v2(72.27,14.31) v2(72.26,13.17) v2(72.27,12.15) v2(72.27,11.14) v2(72.26,10.12) v2(72.27,9.11) v2(72.26,7.84) v2(72.27,6.69) v2(72.27,5.68) v2(72.64,22.57) v2(72.65,21.55) v2(72.65,20.54) v2(73.27,19.52) v2(73.27,16.34) v2(73.27,13.17) v2(73.27,10.12) v2(73.27,7.84) v2(73.28,18.5) v2(73.28,17.49) v2(73.28,15.33) v2(73.28,14.31) v2(73.28,12.15) v2(73.28,11.14) v2(73.28,9.11) v2(73.28,6.69) v2(73.28,5.68) v2(73.65,22.57) v2(73.66,21.55) v2(73.66,20.54) v2(74.28,19.52) v2(74.29,18.5) v2(74.29,17.49) v2(74.28,16.34) v2(74.29,15.33) v2(74.29,14.31) v2(74.28,13.17) v2(74.29,12.15) v2(74.29,11.14) v2(74.28,10.12) v2(74.29,9.11) v2(74.28,7.84) v2(74.29,6.69) v2(74.29,5.68)
VCC+3.3V: length 62.9
  Top Layer w0.686: U1.2 U1.4
  Top Layer w0.711: H4.6 v2(20.19,40.48) 20.19,32.86 18.3,30.97 R5.2 R6.2 ; C2.1 4.1,37.41 4.1,35.15 U1.4 5.97,34.55 6.97,34.55 8.15,35.72 8.15,40.09 8.41,40.09 R3.1 ; v2(8.51,40.48) 8.51,40.47 ; C1.1 10.03,42.38 H4.2
  Bottom Layer w0.711: v2(20.19,40.48) v2(8.51,40.48)
VCC+5V: length 14.4
  Top Layer w0.686: SW1.4 8.64,14.06 6.83,12.26 USB1.B9
  Top Layer w0.711: USB1.A9 4.8,9.26 3.81,10.25 3.81,11.27 4.8,12.26 6.19,12.26 6.2,12.27
(no net):
  vias: v1(3.13,47) v1(3.13,3) v1(72.13,47) v1(72.13,3)
$LED1_2: length 2.5
  Top Layer w0.711: R3.2 12.57,40.38 12.53,40.42
$LED2_2: length 3.5
  Top Layer w0.711: R5.1 23.59,30.19 LED2.2
$LED3_2: length 3.4
  Top Layer w0.711: R6.1 23.63,26.25 LED3.2
$R1_1: length 4
  Top Layer w0.254: USB1.B5 10.21,10.26 R1.1
$R2_1: length 4.8
  Top Layer w0.254: USB1.A5 8.32,11.26 R2.1
P0.0: length 28.5
  Top Layer w0.254: 29.21,45.21 29.21,27.9 32.56,24.55 U2.37 34.58,24.48 ; 29.21,45.21 R7.1 ; 29.21,45.21 H1.1
P0.1: length 26.1
  Top Layer w0.254: H1.2 31.24,45.81 31.24,45.23 ; 31.24,45.23 31.24,27.26 33.16,25.35 U2.36 ; 31.24,45.23 30.28,44.27 R8.1
P0.2: length 26.7
  Top Layer w0.254: U2.35 33.38,26.15 31.88,27.65 31.88,43.9 H1.3 35.07,45.53 R9.1
P0.3: length 25.9
  Top Layer w0.254: U2.34 33.85,26.95 33.02,27.78 33.02,37.3 35.87,40.15 35.88,40.15 36.04,40.32 36.04,40.32 36.83,41.11 H1.4 38.09,45.06 R10.1
P0.4: length 22.7
  Top Layer w0.254: 39.5,46.19 39.5,39.71 36.39,36.6 U2.33 ; 39.5,46.19 40.89,44.79 R11.1 ; 39.5,46.19 H1.5
P0.5: length 23.4
  Top Layer w0.254: U2.32 37.19,33.59 42.16,38.57 42.16,45.94 ; 42.16,45.94 43.74,44.36 R12.1 ; 42.16,45.94 41.91,46.19 H1.6
P0.6: length 24.2
  Top Layer w0.254: 44.7,46.06 H1.7 ; 44.7,46.06 44.7,43.69 44.71,43.68 44.71,40.32 44.7,40.31 44.7,37.43 37.99,30.71 37.99,28.68 ; 44.7,46.06 46.25,44.51 R13.1
P0.7: length 25.3
  Top Layer w0.254: 47.24,46.06 47.24,44.41 47.62,44.03 47.62,38.95 38.79,30.11 U2.30 ; 47.24,46.06 H1.8 ; 47.24,46.06 49.02,44.29 R14.1
P1.0: length 36.7
  Top Layer w0.254: H2.1 28.96,3.01 28.96,19.9 31.2,22.15 U2.40 34.61,22.19 v2(33.02,22.19) ; LED2.1 v2(31.5,24.73)
  Bottom Layer w0.254: v2(33.02,22.19) 33.02,23.33 31.62,24.73 v2(31.5,24.73)
P1.1: length 31.9
  Top Layer w0.254: v2(32.64,21.42) 32.7,21.36 32.7,21.35 ; 25.92,25.99 28.07,23.84 v2(30.23,23.84) ; U2.41 32.7,21.35 ; 32.7,21.35 31.42,21.35 29.97,19.9 29.97,4.53 H2.2
  Bottom Layer w0.254: v2(30.23,23.84) v2(32.64,21.42)
P1.2: length 21.8
  Top Layer w0.254: H2.3 34.29,3.14 31.37,6.06 31.37,19.77 32.14,20.55 U2.42
P1.3: length 20.8
  Top Layer w0.254: H2.4 32.26,7.33 32.26,18.89 33.12,19.75 U2.43
P1.4: length 20
  Top Layer w0.254: U2.44 33.72,18.95 33.02,18.25 33.02,9.11 H2.5
P1.5: length 16.7
  Top Layer w0.254: U2.1 36.39,8.28 H2.6
P1.6: length 17.5
  Top Layer w0.254: U2.2 37.19,10.02 H2.7
P1.7: length 18.2
  Top Layer w0.254: 37.99,17.21 37.99,11.76 H2.8
P2.0: length 48.9
  Top Layer w0.254: SW2.2 72.26,33.99 C10.2 69.33,44.3 H1.16 67.31,40.98 50.08,23.75 U2.18
P2.1: length 64.6
  Top Layer w0.254: SW3.2 72.39,26.37 C11.2 71.5,29.3 73.66,31.46 73.66,41.36 69.21,45.81 69.21,47.21 68.33,48.09 66.55,48.09 H1.15 64.77,39.84 49.48,24.55 U2.19
P2.2: length 29.6
  Top Layer w0.254: H1.14 62.36,46.19 62.36,38.44 49.26,25.35 U2.20
P2.3: length 27.5
  Top Layer w0.254: U2.21 48.79,26.15 59.82,37.17 59.82,46.19 H1.13
P2.4: length 25
  Top Layer w0.254: H1.12 57.15,36.16 47.94,26.95 U2.22
P2.5: length 21.9
  Top Layer w0.254: U2.23 44.39,30 54.55,40.16 54.55,46.25 H1.11
P2.6: length 21.1
  Top Layer w0.254: H1.10 52.07,38.82 43.59,30.34 43.59,28.68
P2.7: length 21.3
  Top Layer w0.254: H1.9 50.55,45.3 50.55,38.44 42.79,30.68 U2.25
P3.0: length 55.4
  Top Layer w0.254: v2(44.45,23.97) 44.32,23.97 39.59,19.23 39.59,12.7 H2.9
  Bottom Layer w0.254: v2(44.45,23.97) 44.96,23.97 58.17,10.76 H5.2
P3.1: length 50.5
  Top Layer w0.254: v2(44.45,18.89) 41.66,18.89 41.19,18.42 U2.7 41.19,13.64 H2.10
  Bottom Layer w0.254: v2(44.45,18.89) 55.12,8.22 H5.1
P3.2: length 19.7
  Top Layer w0.254: H2.11 41.99,15.38 41.99,17.21
P3.3: length 21.3
  Top Layer w0.254: H2.12 55.63,4.28 54.1,4.28 42.79,15.6 U2.9
P3.4: length 23.1
  Top Layer w0.254: 43.59,17.21 43.59,15.69 54.1,5.17 57.53,5.17 59.69,3.01 H2.13
P3.5: length 24.8
  Top Layer w0.254: U2.11 44.39,15.52 53.98,5.93 58.42,5.93 61.59,2.76 H2.14
P3.6: length 25.7
  Top Layer w0.254: U2.12 47.56,18.95 61.34,5.17 62.99,5.17 64.77,3.39 H2.15
P3.7: length 28.6
  Top Layer w0.254: U2.13 47.9,19.75 61.72,5.93 64.77,5.93 67.31,3.39 H2.16
P4.0: length 34.8
  Top Layer w0.254: U2.17 v2(44.32,22.95)
  Bottom Layer w0.254: v2(44.32,22.95) 42.16,20.79 42.16,13.93 32.77,4.53 24.77,4.53 24,3.77 H3.7
P4.1: length 39.6
  Top Layer w0.254: U2.28 v2(40.39,24.47)
  Bottom Layer w0.254: H3.3 19.18,8.34 24.26,8.34 v2(40.39,24.47)
P4.2: length 34.1
  Top Layer w0.254: H3.1 16.38,10.63 18.92,10.63 31.24,22.95 U2.39
P4.3: length 27.4
  Top Layer w0.254: U2.6 v2(40.39,14.06)
  Bottom Layer w0.254: H3.6 21.1,3.01 23.39,5.3 31.62,5.3 v2(40.39,14.06)
P4.4: length 38.7
  Top Layer w0.254: v2(42.04,22.69) 41.99,22.75 41.99,28.68
  Bottom Layer w0.254: H3.5 18.59,3.34 18.24,3.34 21.21,6.31 25.65,6.31 v2(42.04,22.69)
P4.5: length 38.9
  Top Layer w0.254: U2.27 v2(41.19,23.71)
  Bottom Layer w0.254: v2(41.19,23.71) 24.8,7.33 19.81,7.33 16.38,3.9 H3.4
P4.6: length 41
  Top Layer w0.254: 39.59,28.68 v2(39.59,25.11)
  Bottom Layer w0.254: H3.2 17.53,9.23 23.75,9.23 39.59,25.07 v2(39.59,25.11)
RST: length 36.5
  Top Layer w0.254: C9.1 17.02,15.47 SW4.1 18.3,14.69 R4.2 21.73,18.12 v2(22.86,18.12) ; U2.4 38.79,22.14 v2(37.21,23.71)
  Bottom Layer w0.254: v2(37.21,23.71) 31.62,18.12 v2(22.86,18.12)
XTAL1: length 14.2
  Top Layer w0.254: C7.2 56.05,22.69 X2.1 56.83,21.59 56.39,21.15 47.41,21.15 47.21,21.35 U2.15
XTAL2: length 14.2
  Top Layer w0.254: C8.2 56.41,19.25 57.15,19.99 ; 57.15,19.99 X2.2 57.15,19.98 ; 57.15,19.99 56.39,20.75 47.41,20.75 47.21,20.55 U2.14 ; 57.15,19.99 57.15,19.98 ; 57.15,19.98 57.17,19.96

## Copper pours and planes (outline as drawn; the poured copper is in the pictures)
GND on Top Layer: -3.81,51.27 79.37,51.27 79.37,-2.2 -3.81,-2.2
GND on Bottom Layer: -3.56,51.65 80.52,51.65 80.52,-0.55 -3.56,-0.55

Small or netless copper shapes (teardrops, artwork), in the pictures only: 231 on Top Layer, 23 on Bottom Layer

## Text on the board
Bottom Silkscreen Layer: 5V in | GND
Top Silkscreen Layer: OFF | ON | GND | 3.3V | 5V | P4.2 | P4.6 | P4.1 | P4.5 | P4.4 | P4.3 | P4.0 | P1.0 | P0.0 | P0.1 | P1.1 | P0.2 | P1.2 | P0.3 | P1.3 | P0.4 | P1.4 | P0.5 | P1.5 | P1.6 | P0.6 | P0.7 | P1.7 | P2.7 | P3.0 | P2.6 | P3.1 | P2.5 | P3.2 | P2.4 | P3.3 | P3.4 | P2.3 | P3.5 | P2.2 | RX P3.0 | TX P3.1 | P2.1 | P3.6 | P2.0 | P3.7 | PWR | RST | STC89C52RC-40I-LQFP44
